# EAGLE design PCC_LED_Badge_v01 (EAGLE 7.1.0)
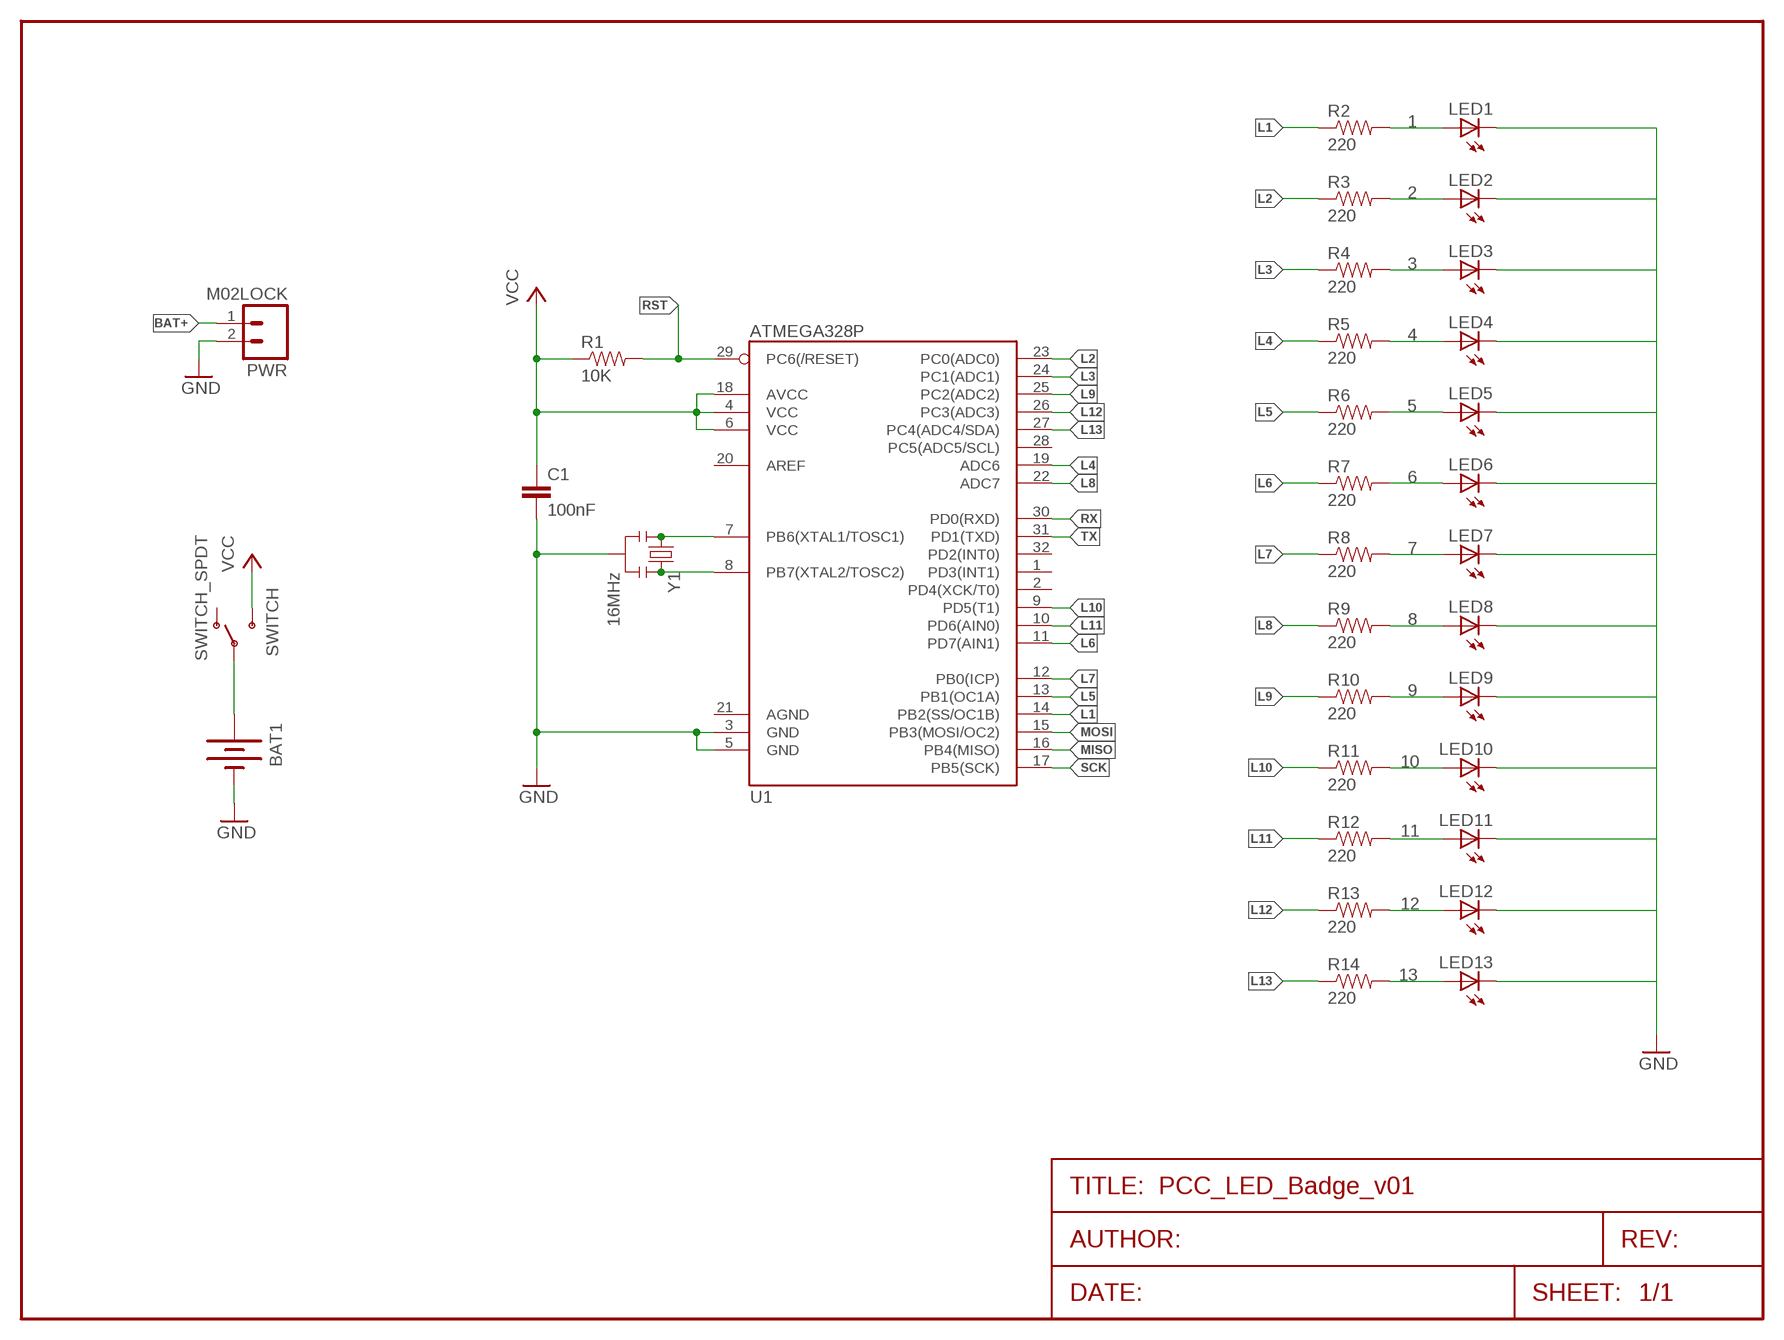
[diagram p0: schematic, sheet 1]

## Parts
BAT1  BATTERY20SMD  [BATTCON_20MM]
C1  100nF  CAP0603-CAP  [0603-CAP]
LED1  LED0603  [LED-0603]
LED2  LED0603  [LED-0603]
LED3  LED0603  [LED-0603]
LED4  LED0603  [LED-0603]
LED5  LED0603  [LED-0603]
LED6  LED0603  [LED-0603]
LED7  LED0603  [LED-0603]
LED8  LED0603  [LED-0603]
LED9  LED0603  [LED-0603]
LED10  LED0603  [LED-0603]
LED11  LED0603  [LED-0603]
LED12  LED0603  [LED-0603]
LED13  LED0603  [LED-0603]
PWR  M02LOCK  [1X02_LOCK]
R1  10K  RESISTOR0603-RES  [0603-RES]
R2  220  RESISTOR0603-RES  [0603-RES]
R3  220  RESISTOR0603-RES  [0603-RES]
R4  220  RESISTOR0603-RES  [0603-RES]
R5  220  RESISTOR0603-RES  [0603-RES]
R6  220  RESISTOR0603-RES  [0603-RES]
R7  220  RESISTOR0603-RES  [0603-RES]
R8  220  RESISTOR0603-RES  [0603-RES]
R9  220  RESISTOR0603-RES  [0603-RES]
R10  220  RESISTOR0603-RES  [0603-RES]
R11  220  RESISTOR0603-RES  [0603-RES]
R12  220  RESISTOR0603-RES  [0603-RES]
R13  220  RESISTOR0603-RES  [0603-RES]
R14  220  RESISTOR0603-RES  [0603-RES]
SWITCH  SWITCH_SPDT  [KPS-1290]
U1  ATMEGA328P  ATMEGA328_SMT  [TQFP32-08]
Y1  16MHz  RESONATOR16MHZ  [RESONATOR-SMD]

## Nets
1: LED1.A R2.2
2: LED2.A R3.2
3: LED3.A R4.2
4: LED4.A R5.2
5: LED5.A R6.2
6: LED6.A R7.2
7: LED7.A R8.2
8: LED8.A R9.2
9: LED9.A R10.2
10: LED10.A R11.2
11: LED11.A R12.2
12: LED12.A R13.2
13: LED13.A R14.2
BAT+: BAT1.1(+) PWR.1 SWITCH.P
GND: BAT1.2(-) C1.2 LED1.C LED2.C LED3.C LED4.C LED5.C LED6.C LED7.C LED8.C LED9.C LED10.C LED11.C LED12.C LED13.C PWR.2 U1.3(GND) U1.5(GND) Y1.2
L1: R2.1 U1.14(PB2(SS/OC1B))
L2: R3.1 U1.23(PC0(ADC0))
L3: R4.1 U1.24(PC1(ADC1))
L4: R5.1 U1.19(ADC6)
L5: R6.1 U1.13(PB1(OC1A))
L6: R7.1 U1.11(PD7(AIN1))
L7: R8.1 U1.12(PB0(ICP))
L8: R9.1 U1.22(ADC7)
L9: R10.1 U1.25(PC2(ADC2))
L10: R11.1 U1.9(PD5(T1))
L11: R12.1 U1.10(PD6(AIN0))
L12: R13.1 U1.26(PC3(ADC3))
L13: R14.1 U1.27(PC4(ADC4/SDA))
MISO: U1.16(PB4(MISO))
MOSI: U1.15(PB3(MOSI/OC2))
N$1: U1.7(PB6(XTAL1/TOSC1)) Y1.1
N$2: U1.8(PB7(XTAL2/TOSC2)) Y1.3
RST: R1.2 U1.29(PC6(/RESET))
RX: U1.30(PD0(RXD))
SCK: U1.17(PB5(SCK))
TX: U1.31(PD1(TXD))
VCC: C1.1 R1.1 SWITCH.S U1.4(VCC) U1.6(VCC) U1.18(AVCC)
Unconnected: SWITCH.O U1.1(PD3(INT1)) U1.2(PD4(XCK/T0)) U1.20(AREF) U1.21(AGND) U1.28(PC5(ADC5/SCL)) U1.32(PD2(INT0))

## Library data of the parts
BAT1 = SparkFun-Electromechanical:BATTERY: Battery Holders Various common sizes : AA, AAA, 20mm coin cell and 12mm coin cell. 20MM_4LEGS, BATT-10373
C1 = SparkFun-Passives:CAP: Capacitor Standard 0603 ceramic capacitor, and 0.1" leaded capacitor.
LED1-LED13 = SparkFun-LED:LED: LEDs Standard schematic elements and footprints for 5mm, 3mm, 1206, and 0603 sized LEDs. 5mm - Spark Fun Electronics SKU : COM-00529 (and others)
PWR = SparkFun-Connectors:M02: Standard 2-pin 0.1" header. Use with - straight break away headers ( PRT-00116) - right angle break away headers (PRT-00553) - swiss pins (PRT-00743) - machine pins (PRT-00117) - female headers (PRT-00115) Molex polarized connector foot print use with: PRT-08233 with associated crimp pins and housings. 2.54_SCREWTERM for use with PRT-10571. 3.5mm Screw Terminal footprints for PRT-08084 5mm Screw Terminal footprints for use with PRT-08433
R1-R14 = SparkFun-Passives:RESISTOR: Resistor Basic schematic elements and footprints for 0603, 1206, and PTH resistors.
SWITCH = SparkFun-Electromechanical:SWITCH_SPDT: Side-actuated SPDT slide switch, as used on the Arduino Pro
U1 = SparkFun-DigitalIC:ATMEGA328_SMT: 32-Pin Atmega328 part Commonly used on Arduino compatible boards Available in QFP and QFN packages TQFP is IC-09069 QFN is non-stock; PROD_ID: IC-09069
Y1 = SparkFun-FreqCtrl:RESONATOR: Resonator Small SMD resonator. Used, eg, on the Arduino Pro/ Pro Mini boards. 8MHz- XTAL-08895 16MHz- XTAL-08900; PROD_ID: XTAL-08900

## Net classes
0 default: width 0.203 mm, clearance 0.203 mm

## Board
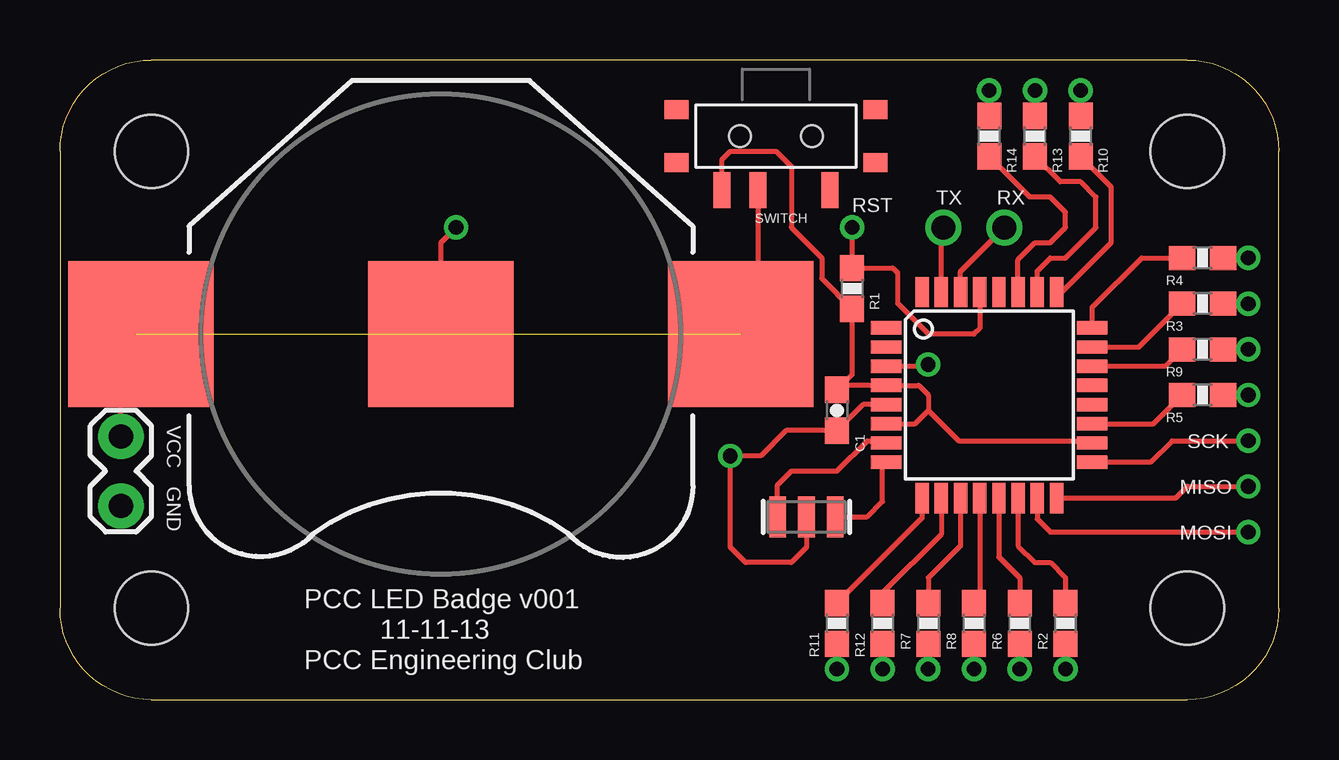
[diagram p1: board, top side]
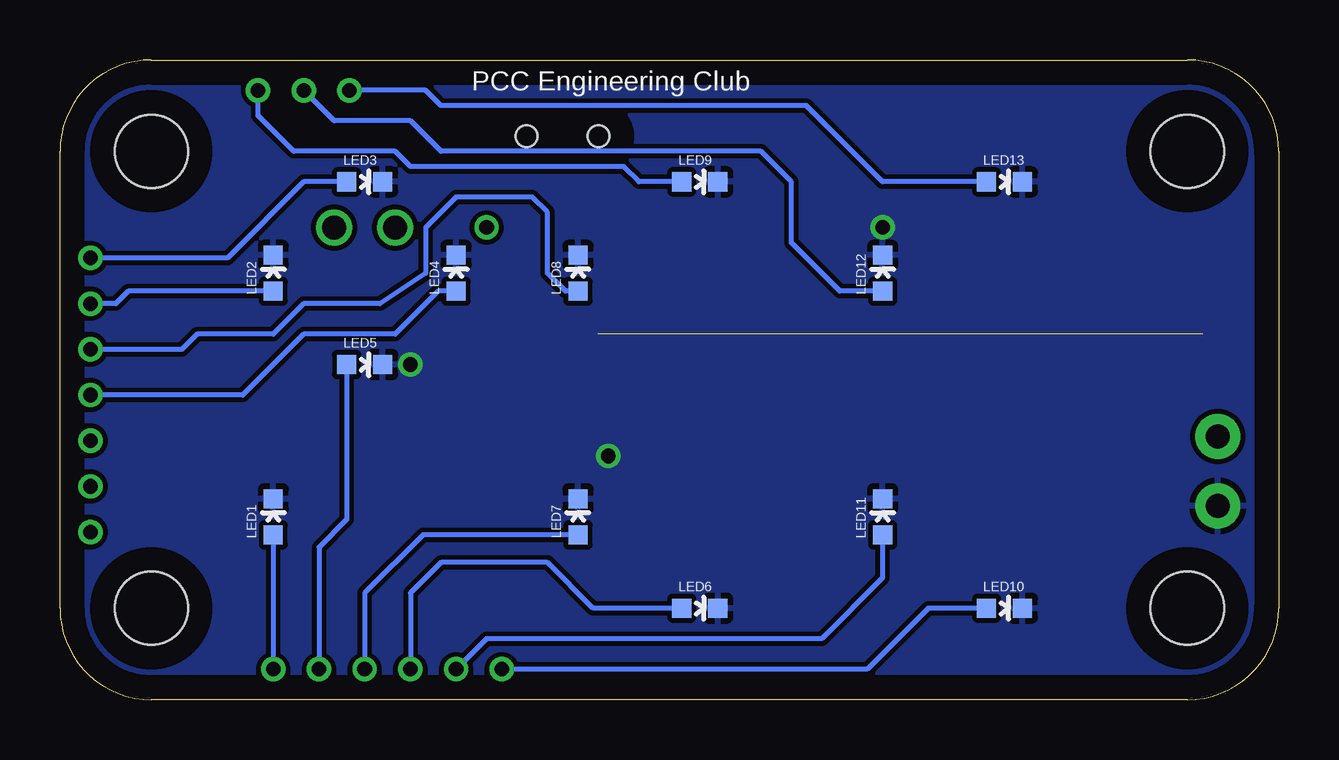
[diagram p2: board, bottom side, seen from below]

Size 50.8 x 26.67 mm. Coordinates in mm from the lower left corner, seen from the top.
Outline: 3.81,0 46.99,0 arc90 50.8,3.81 50.8,22.86 arc90 46.99,26.67 3.81,26.67 arc90 0,22.86 0,3.81 arc90 3.81,0
Copper layers (1*16): Top 0.035mm / dielectric 1.5mm / Bottom 0.035mm
Design rules "default": minimum track width 10mil, minimum drill 24mil, track to track 8mil, track to pad 8mil, pad to pad 8mil, via to via 8mil, smd to smd 8mil, copper to edge 40mil, drill to drill 8mil, minimum pad ring 10mil, minimum via ring 8mil, stop-mask expansion 4mil, vias tented up to drill 0mil, thermal gap 10mil

### Footprints (pad centres in the part's own frame; a part is rotated, then mirrored left to right if it is on the bottom)
BATTCON_20MM = smd 6.07 x 6.07: 1 -12.5,0; 2 0,0; 3 12.5,0
0603-CAP = smd 1.1 x 1: 1 -0.85,0; 2 0.85,0
LED-0603 = smd 0.8 x 0.8: A 0,-0.75; C 0,0.75
1X02_LOCK = drill 1.016 pad 1.88: 1 -0.178,0; 2 2.718,0
0603-RES = smd 1.1 x 1: 1 -0.85,0; 2 0.85,0
KPS-1290 = smd 0.7 x 1.5: O -2.25,2.25; P 0.75,2.25; S 2.25,2.25 | smd 1 x 0.8: P$1 -4.15,1.1; P$2 -4.15,-1.1; P$3 4.15,-1.1; P$4 4.15,1.1 | hole 0.9: -1.5,0; 1.5,0
TQFP32-08 = smd 1.27 x 0.559: 1 -4.293,2.8; 2 -4.293,2; 3 -4.293,1.2; 4 -4.293,0.4; 5 -4.293,-0.4; 6 -4.293,-1.2; 7 -4.293,-2; 8 -4.293,-2.8; 17 4.293,-2.8; 18 4.293,-2; 19 4.293,-1.2; 20 4.293,-0.4; 21 4.293,0.4; 22 4.293,1.2; 23 4.293,2; 24 4.293,2.8 | smd 0.559 x 1.27: 9 -2.8,-4.293; 10 -2,-4.293; 11 -1.2,-4.293; 12 -0.4,-4.293; 13 0.4,-4.293; 14 1.2,-4.293; 15 2,-4.293; 16 2.8,-4.293; 25 2.8,4.293; 26 2,4.293; 27 1.2,4.293; 28 0.4,4.293; 29 -0.4,4.293; 30 -1.2,4.293; 31 -2,4.293; 32 -2.8,4.293
STAND-OFF-TIGHT = hole 3.048: 0,0
RESONATOR-SMD = smd 0.7 x 1.7: 1 -1.2,0; 2 0,0; 3 1.2,0

### Placement (x,y rotation side)
BAT1  15.88,15.24 180 top
C1  32.38,12.06 270 top
LED1  41.91,7.62 0 bottom
LED2  41.91,17.78 0 bottom
LED3  38.1,21.59 270 bottom
LED4  34.29,17.78 0 bottom
LED5  38.1,13.97 270 bottom
LED6  24.13,3.81 270 bottom
LED7  29.21,7.62 0 bottom
LED8  29.21,17.78 0 bottom
LED9  24.13,21.59 270 bottom
LED10  11.43,3.81 270 bottom
LED11  16.51,7.62 0 bottom
LED12  16.51,17.78 0 bottom
LED13  11.43,21.59 270 bottom
PWR  2.54,10.79 270 top
R1  33.02,17.14 90 top
R2  41.91,3.17 270 top
R3  47.62,16.51 0 top
R4  47.62,18.41 0 top
R5  47.62,12.7 0 top
R6  40.01,3.17 270 top
R7  36.2,3.17 270 top
R8  38.1,3.17 270 top
R9  47.62,14.61 0 top
R10  42.55,23.5 90 top
R11  32.38,3.17 270 top
R12  34.29,3.17 270 top
R13  40.64,23.5 90 top
R14  38.73,23.5 90 top
SWITCH  29.84,23.5 180 top
U1  38.73,12.7 0 top
U$2  [STAND-OFF-TIGHT]  3.81,22.86 0 top
U$3  [STAND-OFF-TIGHT]  3.81,3.81 0 top
U$4  [STAND-OFF-TIGHT]  46.99,3.81 0 top
U$5  [STAND-OFF-TIGHT]  46.99,22.86 0 top
Y1  31.11,7.62 0 top

### Tracks (layer width: path | path; a pad name or v marks a point on that pad's centre or on a via)
1  (via drill 0.61)
  Top 0.203: R2.2 v41.91,1.27
  Bottom 0.203: LED1.A v41.91,1.27
2  (via drill 0.61)
  Top 0.203: R3.2 v49.53,16.51
  Bottom 0.203: LED2.A 47.95,17.03 R3.2 v49.53,16.51
3  (via drill 0.61)
  Top 0.203: R4.2 v49.53,18.41
  Bottom 0.203: LED3.A 40.64,21.59 43.81,18.41 v49.53,18.41
4  (via drill 0.61)
  Top 0.203: R5.2 v49.53,12.7
  Bottom 0.203: LED4.A 35.04,17.03 36.83,15.24 40.64,15.24 43.18,12.7 v49.53,12.7
5  (via drill 0.61)
  Top 0.203: R6.2 v40.01,1.27
  Bottom 0.203: LED5.A 38.85,7.5 40.01,6.35 v40.01,1.27
6  (via drill 0.61)
  Top 0.203: R7.2 v36.2,1.27
  Bottom 0.203: LED6.A 28.57,3.81 30.48,5.71 34.92,5.71 36.2,4.45 v36.2,1.27
7  (via drill 0.61)
  Top 0.203: R8.2 v38.1,1.27
  Bottom 0.203: LED7.A 35.67,6.87 38.1,4.45 v38.1,1.27
8  (via drill 0.61)
  Top 0.203: R9.2 v49.53,14.61
  Bottom 0.203: v49.53,14.61 45.72,14.61 45.09,15.24 41.91,15.24 40.64,16.51 37.47,16.51 35.56,17.78 35.56,19.68 34.29,20.95 31.11,20.95 30.48,20.32 30.48,17.78 29.73,17.03 LED8.A
9  (via drill 0.61)
  Top 0.203: R10.2 v42.55,25.4
  Bottom 0.203: v42.55,25.4 R10.2 41.06,22.86 36.83,22.86 36.2,22.23 27.3,22.23 26.67,21.59 LED9.A
10  (via drill 0.61)
  Top 0.203: R11.2 v32.38,1.27
  Bottom 0.203: LED10.A 14.61,3.81 17.14,1.27 v32.38,1.27
11  (via drill 0.61)
  Top 0.203: R12.2 v34.29,1.27
  Bottom 0.203: LED11.A 16.51,5.08 19.05,2.54 33.02,2.54 v34.29,1.27
12  (via drill 0.61)
  Top 0.203: R13.2 v40.64,25.4
  Bottom 0.203: LED12.A 18.3,17.03 20.32,19.05 20.32,21.59 21.59,22.86 34.92,22.86 36.2,24.13 39.37,24.13 v40.64,25.4
13  (via drill 0.61)
  Top 0.203: R14.2 v38.73,25.4
  Bottom 0.203: LED13.A 16.51,21.59 19.68,24.77 34.92,24.77 35.56,25.4 v38.73,25.4
BAT+  (1 unrouted)
  Top 0.203: SWITCH.P 29.09,15.96 BAT1.1 | PWR.1 2.54,14.61 3.17,15.24
  pour Top: 1.27,17.14 1.27,13.34 5.71,13.34 5.71,17.14
GND  (via drill 0.61)
  Top 0.203: Y1.2 31.11,6.35 30.48,5.71 28.57,5.71 27.94,6.35 v27.94,10.16 29.21,10.16 30.27,11.21 C1.2 33.47,12.3 U1.5 | U1.3 36.12,13.9 v36.2,13.97 | BAT1.2 15.88,19.05 v16.51,19.68
  pour Bottom: 0,26.67 0,0 50.8,0 50.8,26.67
L1
  Top 0.203: U1.14 39.94,6.42 40.64,5.71 41.27,5.71 41.91,5.08 R2.1
L2
  Top 0.203: 46.21,15.95 R3.1 44.97,14.7 U1.23
L3
  Top 0.203: 46.7,18.34 R4.1 45.09,18.41 43.03,16.36 U1.24
L4
  Top 0.203: U1.19 45.58,11.5 R5.1
L5
  Top 0.203: U1.13 39.13,5.95 40.01,5.08 R6.1
L6
  Top 0.203: U1.11 37.53,6.42 36.2,5.08 R7.1
L7
  Top 0.203: U1.12 38.34,4.26 R8.1
L8
  Top 0.203: U1.22 46.07,13.9 R9.1
L9
  Top 0.203: U1.25 41.76,16.99 43.81,19.05 43.81,21.38 R10.1
L10
  Top 0.203: U1.9 35.94,7.58 R11.1
L11
  Top 0.203: U1.10 36.73,6.89 34.29,4.45 R12.1
L12
  Top 0.203: 40.73,22.55 R13.1 41.7,21.59 42.55,21.59 43.18,20.95 43.18,19.68 41.91,18.41 41.27,18.41 40.73,17.88 U1.26
L13
  Top 0.203: U1.27 39.94,18.34 40.64,19.05 41.27,19.05 41.91,19.68 41.91,20.32 41.27,20.95 40.42,20.95 R14.1
MISO  (via drill 0.61)
  Top 0.203: U1.16 46.51,8.41 46.99,8.89 v49.53,8.89
MOSI  (via drill 0.61)
  Top 0.203: U1.15 40.73,7.53 41.27,6.99 v49.53,6.99
N$1
  Top 0.203: Y1.1 29.91,8.96 30.48,9.53 32.38,9.53 33.66,10.79 34.35,10.79 U1.7
N$2
  Top 0.203: Y1.3 33.66,7.62 34.29,8.26 34.29,9.75 U1.8
RST  (via drill 0.61)
  Top 0.203: U1.29 38.34,15.47 38.1,15.24 36.2,15.24 34.92,16.51 34.92,17.78 34.71,18 R1.2 v33.02,19.68
RX  (via drill 1)
  Top 0.203: U1.30 37.53,17.85 v39.37,19.68
SCK  (via drill 0.61)
  Top 0.203: U1.17 45.46,9.9 46.35,10.79 v49.53,10.79
TX  (via drill 1)
  Top 0.203: U1.31 36.73,19.59 v36.83,19.68
VCC
  Top 0.203: U1.6 35.63,11.5 36.2,12.06 | 36.2,12.06 36.2,12.7 35.8,13.1 U1.4 32.57,13.1 C1.1 33.02,13.55 R1.1 31.75,17.57 31.75,18.41 30.48,19.68 30.48,22.23 29.84,22.86 27.94,22.86 27.59,22.52 SWITCH.S | 36.2,12.06 37.47,10.79 42.93,10.79 U1.18

### Text on the board
tPlace: TX | RX | RST | VCC | SCK | GND | MISO | MOSI | PCC LED Badge v001 | 11-11-13 | PCC Engineering Club
bPlace: PCC Engineering Club